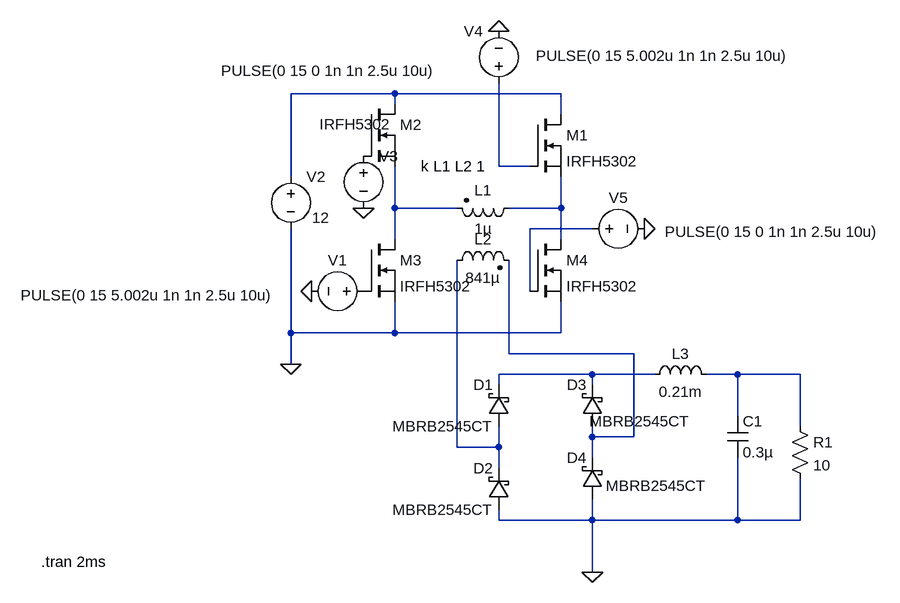
[diagram p0: schematic DC 3.asc]
DC 3.asc, the LTspice schematic file:
Version 4
SHEET 1 912 752
WIRE 160 0 0 0
WIRE 416 0 160 0
WIRE 160 16 160 0
WIRE 416 32 416 0
WIRE 320 112 320 -16
WIRE 368 112 320 112
WIRE 0 128 0 0
WIRE 160 176 160 112
WIRE 256 176 160 176
WIRE 416 176 416 128
WIRE 416 176 336 176
WIRE 464 208 368 208
WIRE 160 224 160 176
WIRE 416 224 416 176
WIRE 368 304 368 208
WIRE 0 368 0 208
WIRE 160 368 160 320
WIRE 160 368 0 368
WIRE 416 368 416 320
WIRE 416 368 160 368
WIRE 336 400 336 256
WIRE 528 400 336 400
WIRE 0 416 0 368
WIRE 464 432 320 432
WIRE 560 432 464 432
WIRE 688 432 640 432
WIRE 784 432 688 432
WIRE 320 448 320 432
WIRE 464 448 464 432
WIRE 688 496 688 432
WIRE 784 512 784 432
WIRE 464 528 464 512
WIRE 528 528 528 400
WIRE 528 528 464 528
WIRE 256 544 256 256
WIRE 320 544 320 512
WIRE 320 544 256 544
WIRE 464 560 464 528
WIRE 320 576 320 544
WIRE 320 656 320 640
WIRE 464 656 464 624
WIRE 464 656 320 656
WIRE 688 656 688 560
WIRE 688 656 464 656
WIRE 784 656 784 592
WIRE 784 656 688 656
WIRE 464 736 464 656
FLAG 0 416 0
FLAG 112 176 0
FLAG 320 -96 0
FLAG 32 304 0
FLAG 544 208 0
FLAG 464 736 0
SYMBOL nmos 112 224 R0
SYMATTR InstName M3
SYMATTR Value IRFH5302
SYMBOL nmos 368 224 R0
SYMATTR InstName M4
SYMATTR Value IRFH5302
SYMBOL nmos 368 32 R0
SYMATTR InstName M1
SYMATTR Value IRFH5302
SYMBOL voltage 128 304 R90
WINDOW 0 -32 56 VBottom 2
WINDOW 3 -9 348 VTop 2
SYMATTR InstName V1
SYMATTR Value PULSE(0 15 5.002u 1n 1n 2.5u 10u)
SYMBOL voltage 0 112 R0
WINDOW 3 33 79 Left 2
SYMATTR Value 12
SYMATTR InstName V2
SYMBOL nmos 112 16 R0
WINDOW 3 -68 31 Left 2
SYMATTR Value IRFH5302
SYMATTR InstName M2
SYMBOL voltage 112 80 R0
WINDOW 3 -219 -115 Left 2
SYMATTR Value PULSE(0 15 0 1n 1n 2.5u 10u)
SYMATTR InstName V3
SYMBOL ind2 352 160 R90
WINDOW 0 4 56 VBottom 2
WINDOW 3 32 56 VTop 2
SYMATTR InstName L1
SYMATTR Value 1µ
SYMBOL ind2 240 272 R270
WINDOW 0 32 56 VTop 2
WINDOW 3 4 56 VBottom 2
SYMATTR InstName L2
SYMATTR Value 841µ
SYMBOL schottky 336 512 R180
WINDOW 0 24 64 Left 2
WINDOW 3 24 0 Left 2
SYMATTR InstName D1
SYMATTR Value MBRB2545CT
SYMBOL schottky 336 640 R180
WINDOW 0 24 64 Left 2
WINDOW 3 24 0 Left 2
SYMATTR InstName D2
SYMATTR Value MBRB2545CT
SYMBOL schottky 480 512 R180
WINDOW 0 24 64 Left 2
WINDOW 3 -135 8 Left 2
SYMATTR InstName D3
SYMATTR Value MBRB2545CT
SYMBOL schottky 480 624 R180
WINDOW 0 24 64 Left 2
WINDOW 3 -160 21 Left 2
SYMATTR InstName D4
SYMATTR Value MBRB2545CT
SYMBOL voltage 320 0 R180
WINDOW 0 24 96 Left 2
WINDOW 3 -449 58 Left 2
SYMATTR InstName V4
SYMATTR Value PULSE(0 15 5.002u 1n 1n 2.5u 10u)
SYMBOL voltage 448 208 R270
WINDOW 0 32 56 VTop 2
WINDOW 3 11 293 VBottom 2
SYMATTR InstName V5
SYMATTR Value PULSE(0 15 0 1n 1n 2.5u 10u)
SYMBOL ind 544 448 R270
WINDOW 0 32 56 VTop 2
WINDOW 3 5 56 VBottom 2
SYMATTR InstName L3
SYMATTR Value 0.21m
SYMBOL cap 672 496 R0
SYMATTR InstName C1
SYMATTR Value 0.3µ
SYMBOL res 768 496 R0
SYMATTR InstName R1
SYMATTR Value 10
TEXT -384 720 Left 2 !.tran 2ms
TEXT 200 112 Left 2 !k L1 L2 1

The netlist it stands for:
* DC 3.asc
M3 N003 P001 0 0 IRFH5302
M4 N004 N005 0 0 IRFH5302
M1 N001 N002 N004 N004 IRFH5302
V1 P001 0 PULSE(0 15 5.002u 1n 1n 2.5u 10u)
V2 N001 0 12
M2 N001 P002 N003 N003 IRFH5302
V3 P002 0 PULSE(0 15 0 1n 1n 2.5u 10u)
L1 N004 N003 1µ
L2 N009 N006 841µ
D1 N009 N007 MBRB2545CT
D2 0 N009 MBRB2545CT
D3 N006 N007 MBRB2545CT
D4 0 N006 MBRB2545CT
V4 N002 0 PULSE(0 15 5.002u 1n 1n 2.5u 10u)
V5 N005 0 PULSE(0 15 0 1n 1n 2.5u 10u)
L3 N007 N008 0.21m
C1 N008 0 0.3µ
R1 N008 0 10
.model D D
.lib standard.dio
.model NMOS NMOS
.model PMOS PMOS
.lib standard.mos
.tran 2ms
k L1 L2 1
.backanno
.end